# Altium schematic sheet Display.SchDoc
size 420 x 297 mm; SheetNumber: 5; SheetTotal: 11; SPICEModelCacheWZVAXILY: <root> / <DocumentId>WZVAXILY</DocumentId> / <CacheFrame Number="0"> / <Model Name="0603_885012206095_100nf" Kind="CKT"> / <Text>******* / .subckt 0603_885012206095_100nF 1 2 / Rser 1 3 0.0157659152881 / Lser 2 4 3.10171966E-10 / C1 3 4 0.0000001 / Rpar 3 4 5000000000 / .ends 0603_885012206095_100nF</Text> / </Model> / <Model Name="0603_885012106006_10uf" Kind="CKT"> / <Text>******* / .subckt 0603_885012106006_10uF 1 2 / Rser 1 3 0.00407641026021 / Lser 2 4 4.16060333E-10 / C1 3 4 0.00001 / Rpar 3 4 5000000 / .ends 0603_885012106006_10uF</Text> / </Model> / </CacheFrame> / </root>
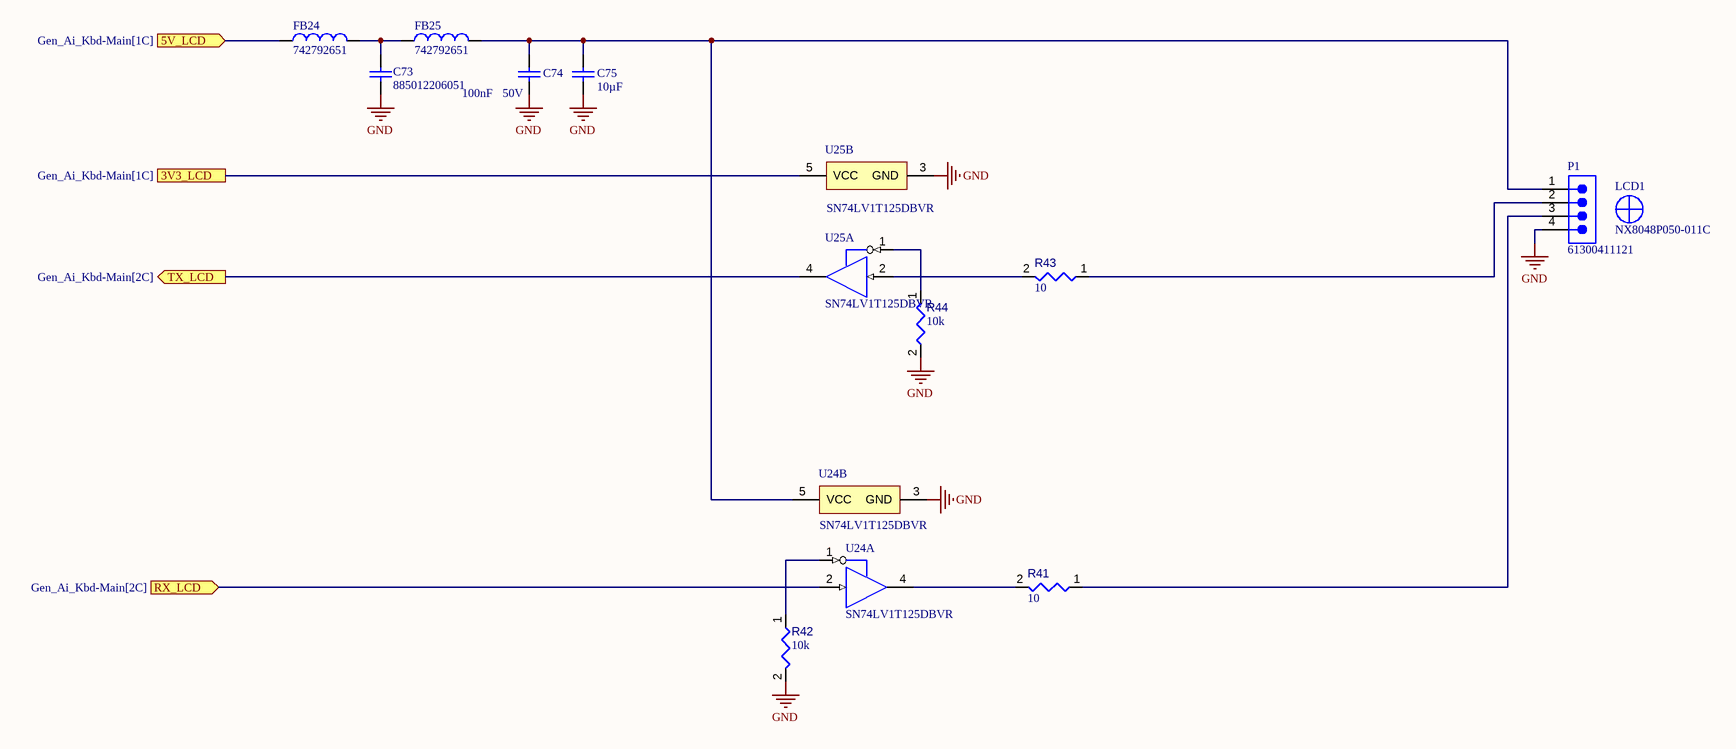
[diagram p0: Display.SchDoc]

## Parts
C73  885012206051  [WCAP-CSGP_0603_L1.6W0.8H0.8_Reflow]
C74  Capacitance: 100nF  Rated Voltage (DC): 50V  [WCAP-CSGP_0603_L1.6W0.8H0.8_Reflow]  (hidden comment: 885012206095)
C75  Capacitance: 10µF  [WCAP-CSGP_0603_L1.6W0.8H0.8_Reflow]  (hidden comment: 885012106006)
FB24  742792651  [WE-CBF_0603_L1.6W0.8H0.8_HC]
FB25  742792651  [WE-CBF_0603_L1.6W0.8H0.8_HC]
LCD1  NX8048P050-011C  [NEXTION 5.5Inch]
P1  61300411121  [61300411121]
R41  value 10  [RESC1608X55X25ML10T15]  (hidden comment: Resistor 10k +/-1% 0603 100 mW)
R42  value 10k  [RESC1608X55X25ML10T15]  (hidden comment: Resistor 10k +/-1% 0603 100 mW)
R43  value 10  [RESC1608X55X25ML10T15]  (hidden comment: Resistor 10k +/-1% 0603 100 mW)
R44  value 10k  [RESC1608X55X25ML10T15]  (hidden comment: Resistor 10k +/-1% 0603 100 mW)
U24  SN74LV1T125DBVR  [DBV0005A_M]  (parts A,B of 2)
U25  SN74LV1T125DBVR  [DBV0005A_M]  (parts A,B of 2)

## Ports
3V3_LCD (see Gen_Ai_Kbd-Main[1C]), 5V_LCD (in, see Gen_Ai_Kbd-Main[1C]), RX_LCD (in, see Gen_Ai_Kbd-Main[2C]), TX_LCD (out, see Gen_Ai_Kbd-Main[2C])

## Nets
GND: C73.1 C74.1 C75.1 P1.4 R42.2 R44.2 U24.3(GND) U25.3(GND)
3V3_LCD: U25.5(VCC) ; port 3V3_LCD
5V_LCD: FB24.1 ; port 5V_LCD
RX_LCD: U24.2(A) ; port RX_LCD
TX_LCD: U25.4(Y) ; port TX_LCD
NetC73_2: C73.2 FB24.2 FB25.1
NetC74_2: C74.2 C75.2 FB25.2 P1.1 U24.5(VCC)
NetP1_2: P1.2 R43.1
NetP1_3: P1.3 R41.1
NetR41_2: R41.2 U24.4(Y)
NetR42_1: R42.1 U24.1(~{OE})
NetR43_2: R43.2 U25.2(A)
NetR44_1: R44.1 U25.1(~{OE})

Not connected (* = marked no-connect by the designer): LCD1 1

## Notes on the sheet
- THIS DOCUMENT AND THE DATA DISCLOSED HEREIN OR
- HEREWITH IS THE PROPERTY OF SUMASTA TECH AND MAY
- DWG NO:
- REVISION
- REV:
- DESCRIPTION
- DATE
- APPROVED
- BE FREELY DISTRIBUTED IN WHOLE. NO RIGHTS ARE
- THIS DOCUMENT IS SUBJECT TO CHANGE WITHOUT NOTICE
- RESERVED OR EXPRESS OR IMPLIED WARANTEE GIVEN.
- PROJECT
- sumasta
- t
- PROJECT REVISION:
- TITLE
- DOCUMENT REVISION:
- DESIGN ITEM:
- SCALE:
- A3
- SIZE
- CAGE CODE
- FILE NAME
- DWG NO.
- SHEET
- OF
- REV

## Library data of the parts
C73 = CMP-03913-53914760-1: 885012206051 Cap Cer 0.68UF 16V X7R 0603; Insulation Resistance: 700MΩ; Tolerance: 10%; Capacitance: 680nF; NexarPartId: 53914760; Dielectric: X7R; Max Operating Temperature: 125°C; Thickness: 939.8µm; Case Code (Imperial): 0603; Length: 1.6mm; RoHS: Compliant; Min Operating Temperature: -55°C; Width: 800µm; Mount: Surface Mount; Height: 800µm; Case/Package: 0603; Case Code (Metric): 1608; Voltage Rating (DC): 16V; Packaging: Tape & Reel (TR); Voltage Rating: 16V
C74 = CMP-007-000655-1: WCAP-CSGP Multilayer Ceramic Chip Capacitor, General Purpose, size 0603, X7R, 100nF, 50VDC; Manufacturer: Wurth Elektronik; Capacitance Tolerance: +/-10%; Insulation Resistance: 5GO; Case/Size Code: 0603; Technical Reference: X7R0603104K050DFCT10000; Dissipation Factor: 3%; Operating Temperature Max: 125°C; Category: Multilayer Ceramic Chip Capacitors; ComponentLink1Description: Website Link; Manufacturer Part Number: 885012206095; Pin Count: 2; Ceramic Type: X7R; Component Type: Standard; Mount: Surface Mount; Operating Temperature Min: -55°C; Source: WCAP-CSGP.SchLib; ComponentLink2URL: https://www.we-online.com/redexpert/spec/885012206095?ad; Packaging: Tape and Reel; Match Code: WCAP-CSGP; Width: 0.8mm; ComponentLink1URL: https://www.we-online.com/redexpert/article/885012206095?ad; Height: 0.8mm; Design Item ID: 885012206095; Length: 1.6mm; ComponentLink2Description: Datasheet Link
C75 = CMP-007-000403-1: WCAP-CSGP Multilayer Ceramic Chip Capacitor, General Purpose, size 0603, X5R, 10µF, 6.3VDC; Manufacturer: Wurth Elektronik; Rated Voltage (DC): 6.3V; Insulation Resistance: 0.01GO; Technical Reference: X5R0603106M6R3DFCT10000; Dissipation Factor: 10%; Case/Size Code: 0603; Capacitance Tolerance: +/-20%; Mount: Surface Mount; Packaging: Tape and Reel; ComponentLink1URL: https://www.we-online.com/redexpert/article/885012106006?ad; Height: 0.8mm; ComponentLink2URL: https://www.we-online.com/redexpert/spec/885012106006?ad; Category: Multilayer Ceramic Chip Capacitors; Operating Temperature Max: 85°C; Operating Temperature Min: -55°C; Source: WCAP-CSGP.SchLib; Match Code: WCAP-CSGP; Design Item ID: 885012106006; Ceramic Type: X5R; Manufacturer Part Number: 885012106006; Component Type: Standard; Pin Count: 2; Width: 0.8mm; ComponentLink2Description: Datasheet Link; ComponentLink1Description: Website Link; Length: 1.6mm
FB24 FB25 = CMP-0220-00181-3: NexarPartId: 7864500; RMS Current (Irms): 1A; Number of Lines: 1; Test Frequency: 100MHz; Impedance: 600Ω; Inductance: 360mH; Resistance: 200mΩ; Tolerance: 25%; Case Code (Imperial): 0603; Lead Free: Lead Free; Current Rating: 1A; Height: 800µm; Min Operating Temperature: -55°C; Core Material: Ferrite; REACH SVHC: Unknown; Case/Package: 0603; Weight: 3.997283mg; Mount: Surface Mount; Termination: SMD/SMT; Case Code (Metric): 1608; DC Resistance (DCR): 200mΩ; Series Resistance: 200mΩ; Max Operating Temperature: 125°C; Width: 800µm; Length: 1.6mm; Max DC Current: 1A; RoHS: Compliant; Material: Ferrite; Max Current Rating: 1A; Depth: 800µm; Packaging: Cut Tape (CT)
LCD1 = CMP-00028-00007-2: Nextion 5.5 Inch LCD
P1 = CMP-1502-01064-2: NexarPartId: 32855522; Pitch: 2.54mm; Number of Contacts: 4; Contact Resistance: 20mΩ; Gender: Male; Current Rating: 3A; Connector Type: Male Pin; Voltage Rating: 250V; Lead Free: Lead Free; Contact Plating: Gold; Max Operating Temperature: 105°C; Packaging: Bulk; Height: 8.89mm; Orientation: Vertical; Contact Mating Length: 5.9944mm; Contact Material: Copper; Lead Pitch: 2.54mm; Min Operating Temperature: -40°C; Termination: Solder; Color: Black; Number of Rows: 1; REACH SVHC: Unknown; RoHS: Compliant; Mount: Through Hole; Number of Positions: 4; Number of Pins: 4; Operating Supply Voltage: 250V
R41-R44 = CMP-009-00017-5: Chip Resistor, 10 KOhm, +/- 1%, 01 W, -55 to 155 degC, 0603 (1608 Metric); Voltage Rating: 50V; Power: 100mW; RoHS Compliant: True; Min Operating Temperature: -55°C; Pins: 2; Case/Package: 0603; Mounting Technology: SM; Max Operating Temperature: 155°C; Tolerance: 1%
U24 U25 = CMP-0859-00122-3: Single Power Supply, Single BUFFER GATE w/ 3-State Output (active low enable), DBV0005A, LARGE T&R; Manufacturer: Texas Instruments; Schmitt Trigger: No; Sub-Family: Non-Inverting Buffer/Driver; Voltage(Nom)(V): 1.8,2.5,3.3,5.5; Output Drive (IOL/IOH)(Max)(mA): 8/-8; Bits(#): 1; Technology Family: LV1T; F @ Nom Voltage(Max)(Mhz): 50; Output Type: CMOS; Input Type: TTL; VCC(Min)(V): 1.6; tpd @ Nom Voltage(Max)(ns): 14.5,9.5,8.0,6.5; 3-State Output: Yes; ICC @ Nom Voltage(Max)(mA): 0.01; Rating: Catalog; Logic: True; Special Features: 1.8V to 3.3V Up Translation,3.3V to 1.8V Down Translation,5V Input Tolerant; VCC(Max)(V): 5.5; PackageReference: DBV0005A; Generic Part Number: SN74LV1T125; Operating Temperature Range(C): -40 to 125; DatasheetVersion: SCLS745A